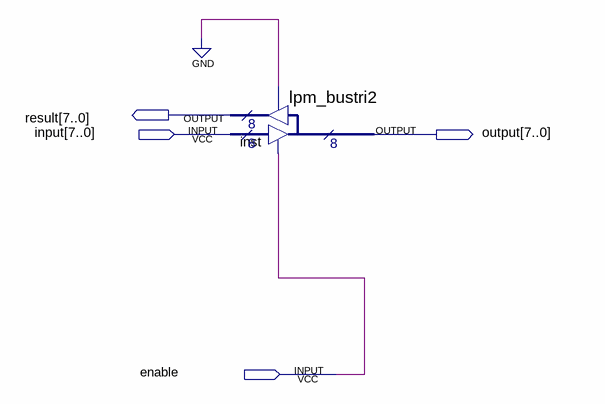
[diagram p0: schematic sheet]
// Quartus schematic TestBustri.bdf as structural Verilog: 1 symbols, 4 pins
module TestBustri (
  input  [7:0] \input ,
  input  enable,
  output [7:0] result,
  output [7:0] \output 
);

  lpm_bustri2 inst (.enabledt(enable), .data(\input ), .enabletr(1'b0), .result(result), .tridata(\output ));
endmodule
